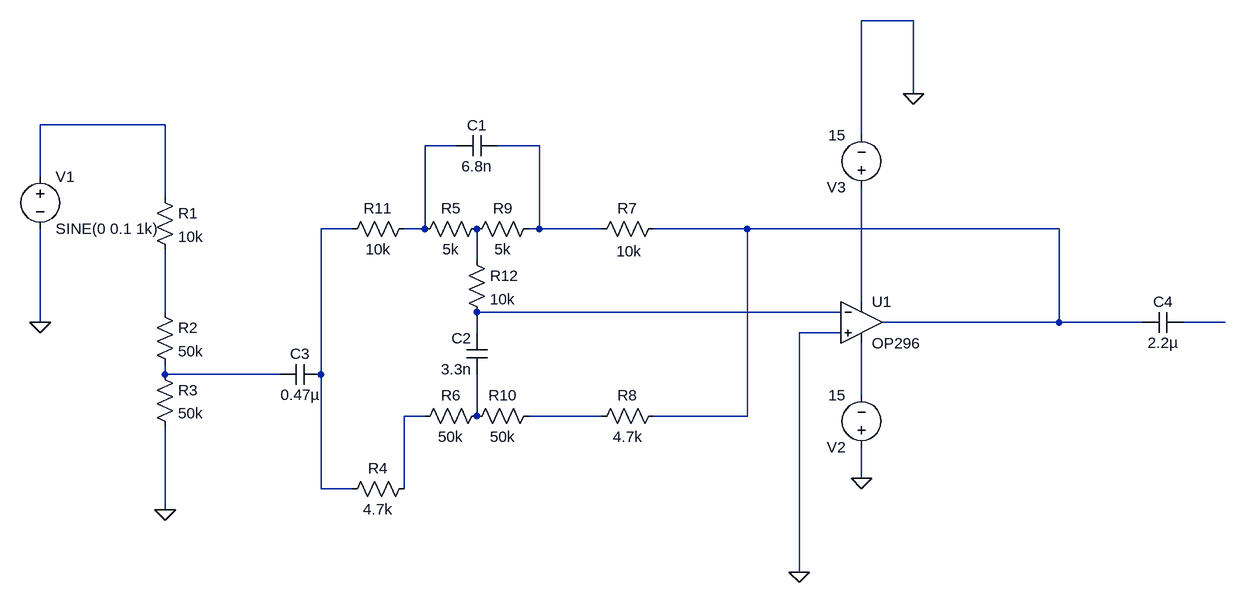
[diagram p0: schematic ToneController.asc]
ToneController.asc, the LTspice schematic file:
Version 4
SHEET 1 1668 680
WIRE 1184 -240 1104 -240
WIRE 1184 -128 1184 -240
WIRE 32 -80 -160 -80
WIRE 1104 -64 1104 -240
WIRE 480 -48 432 -48
WIRE 608 -48 544 -48
WIRE -160 0 -160 -80
WIRE 32 32 32 -80
WIRE 320 80 272 80
WIRE 432 80 432 -48
WIRE 432 80 400 80
WIRE 608 80 608 -48
WIRE 608 80 592 80
WIRE 704 80 608 80
WIRE 928 80 784 80
WIRE 1408 80 928 80
WIRE 512 128 512 80
WIRE 1104 192 1104 16
WIRE 32 208 32 112
WIRE 1072 208 512 208
WIRE -160 224 -160 80
WIRE 1408 224 1408 80
WIRE 1408 224 1136 224
WIRE 1536 224 1408 224
WIRE 1664 224 1600 224
WIRE 512 240 512 208
WIRE 1072 240 1008 240
WIRE 32 304 32 288
WIRE 208 304 32 304
WIRE 272 304 272 80
WIRE 1104 336 1104 256
WIRE 432 368 400 368
WIRE 512 368 512 304
WIRE 704 368 592 368
WIRE 928 368 928 80
WIRE 928 368 784 368
WIRE 1104 464 1104 416
WIRE 272 480 272 304
WIRE 320 480 272 480
WIRE 400 480 400 368
WIRE 32 512 32 384
WIRE 1008 608 1008 240
FLAG 32 512 0
FLAG 1008 608 0
FLAG -160 224 0
FLAG 1184 -128 0
FLAG 1104 464 0
SYMBOL res 16 16 R0
SYMATTR InstName R1
SYMATTR Value 10k
SYMBOL res 16 192 R0
SYMATTR InstName R2
SYMATTR Value 50k
SYMBOL res 16 288 R0
SYMATTR InstName R3
SYMATTR Value 50k
SYMBOL res 528 64 R90
WINDOW 0 0 56 VBottom 2
WINDOW 3 32 56 VTop 2
SYMATTR InstName R5
SYMATTR Value 5k
SYMBOL res 528 352 R90
WINDOW 0 0 56 VBottom 2
WINDOW 3 32 56 VTop 2
SYMATTR InstName R6
SYMATTR Value 50k
SYMBOL res 800 64 R90
WINDOW 0 0 56 VBottom 2
WINDOW 3 35 54 VTop 2
SYMATTR InstName R7
SYMATTR Value 10k
SYMBOL res 800 352 R90
WINDOW 0 0 56 VBottom 2
WINDOW 3 32 56 VTop 2
SYMATTR InstName R8
SYMATTR Value 4.7k
SYMBOL res 608 64 R90
WINDOW 0 0 56 VBottom 2
WINDOW 3 32 56 VTop 2
SYMATTR InstName R9
SYMATTR Value 5k
SYMBOL res 608 352 R90
WINDOW 0 0 56 VBottom 2
WINDOW 3 32 56 VTop 2
SYMATTR InstName R10
SYMATTR Value 50k
SYMBOL res 416 64 R90
WINDOW 0 0 56 VBottom 2
WINDOW 3 32 56 VTop 2
SYMATTR InstName R11
SYMATTR Value 10k
SYMBOL cap 544 -64 R90
WINDOW 0 0 32 VBottom 2
WINDOW 3 32 32 VTop 2
SYMATTR InstName C1
SYMATTR Value 6.8n
SYMBOL cap 528 304 R180
WINDOW 0 24 56 Left 2
WINDOW 3 24 8 Left 2
SYMATTR InstName C2
SYMATTR Value 3.3n
SYMBOL cap 272 288 R90
WINDOW 0 0 32 VBottom 2
WINDOW 3 32 32 VTop 2
SYMATTR InstName C3
SYMATTR Value 0.47µ
SYMBOL res 416 464 R90
WINDOW 0 0 56 VBottom 2
WINDOW 3 32 56 VTop 2
SYMATTR InstName R4
SYMATTR Value 4.7k
SYMBOL res 496 112 R0
SYMATTR InstName R12
SYMATTR Value 10k
SYMBOL OpAmps\\OP296 1104 160 R0
SYMATTR InstName U1
SYMBOL cap 1600 208 R90
WINDOW 0 0 32 VBottom 2
WINDOW 3 32 32 VTop 2
SYMATTR InstName C4
SYMATTR Value 2.2µ
SYMBOL voltage -160 -16 R0
WINDOW 123 0 0 Left 0
WINDOW 39 0 0 Left 0
SYMATTR InstName V1
SYMATTR Value SINE(0 0.1 1k)
SYMBOL voltage 1104 432 R180
WINDOW 123 0 0 Left 0
WINDOW 39 0 0 Left 0
SYMATTR InstName V2
SYMATTR Value 15
SYMBOL voltage 1104 32 R180
WINDOW 123 0 0 Left 0
WINDOW 39 0 0 Left 0
SYMATTR InstName V3
SYMATTR Value 15

The netlist it stands for:
* ToneController.asc
R1 N001 N008 10k
R2 N008 N011 50k
R3 N011 0 50k
R5 N006 N002 5k
R6 N014 N013 50k
R7 N005 N003 10k
R8 N005 N015 4.7k
R9 N003 N006 5k
R10 N015 N014 50k
R11 N002 N004 10k
C1 N003 N002 6.8n
C2 N014 N009 3.3n
C3 N004 N011 0.47µ
R4 N013 N004 4.7k
R12 N006 N009 10k
XU1 0 N009 N007 N012 N005 OP296  ; pins In+ In- V+ V- OUT
C4 N010 N005 2.2µ
V1 N001 0 SINE(0 0.1 1k)
V2 0 N012 15
V3 N007 0 15
.backanno
.end